# Altium project radxa_cm5_io_board_v2200_SCH-1.PrjPcb (part 5 of 5)

## Sheet 19_KEY_LED.SchDoc
size 246 x 182 mm
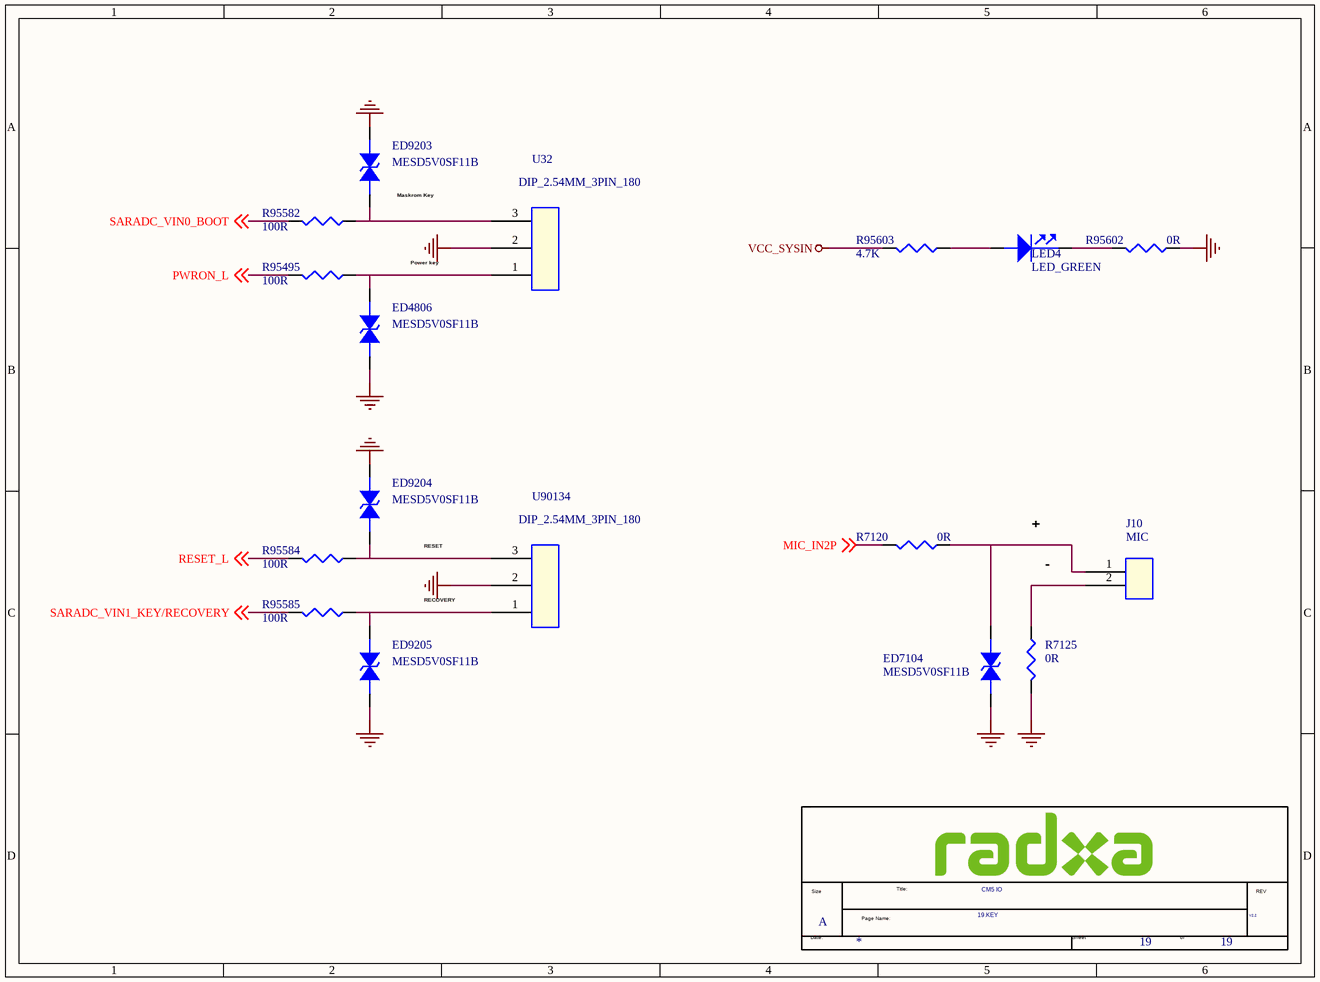
[diagram p19: 19_KEY_LED.SchDoc]

### Parts
(Parts that share a designator on the sheet are numbered #1, #2 ... from top to bottom, then left to right.)
*#19  Doc: 19.KEY  RevCode: V2.2  Title: CM5 IO  Page Size: A  Page Number: 19  (hidden comment: radxa_1010)  (graphical)
ED4806  MESD5V0SF11B  [E0402N]
ED7104  MESD5V0SF11B  [ESD0402]
ED9203  MESD5V0SF11B  [E0402N]
ED9204  MESD5V0SF11B  [E0402N]
ED9205  MESD5V0SF11B  [E0402N]
J10  MIC  [DIP2PIN-2P54MM]
LED4  LED_GREEN  [LED0603]
R7120  0R  [R0402]
R7125  0R  [R0402]
R95495  100R  [R0402]
R95582  100R  [R0402]
R95584  100R  [R0402]
R95585  100R  [R0402]
R95602  0R  [R0402]
R95603  4.7K  [R0402]
U32  DIP_2.54MM_3PIN_180  [DIP3_1X2P54]
U90134  DIP_2.54MM_3PIN_180  [DIP3_1X2P54]

### Nets
GND: ED4806.2 ED7104.2 ED9203.2 ED9204.2 ED9205.2 R7125.2 R95602.2 U32.2 U90134.2
VCC_SYSIN: R95603.1
MIC_IN2P: R7120.1 ; off-sheet MIC_IN2P
PWRON_L: R95495.1 ; off-sheet PWRON_L
RESET_L: R95584.1 ; off-sheet RESET_L
SARADC_VIN0_BOOT: R95582.1 ; off-sheet SARADC_VIN0_BOOT
SARADC_VIN1_KEY/RECOVERY: R95585.1 ; off-sheet SARADC_VIN1_KEY/RECOVERY
NetED4806_1: ED4806.1 R95495.2 U32.1
NetED7104_1: ED7104.1 J10.1 R7120.2
NetED9203_1: ED9203.1 R95582.2 U32.3
NetED9204_1: ED9204.1 R95584.2 U90134.3
NetED9205_1: ED9205.1 R95585.2 U90134.1
NetJ10_2: J10.2 R7125.1
NetLED4_1: LED4.1(ANODE) R95603.2
NetLED4_2: LED4.2(CATHODE) R95602.1

### Notes on the sheet
- (near ED9203) Maskrom Key
- Power key
- +
- RESET
- RECOVERY
- -
- (in symbol radxa_1010) Size; Title:; REV; Page Name:; Date:; Sheet; of

### Library data of the parts
ED4806 ED9203 = TVS: ESD Component,5V,30P,SMD,0402; BOM_TYPE: 40; BOM_VALUE: 0; PCB Footprint: E0402N
ED7104 = DIODE BI_DIR TRIG_2: 1-Line, Bi-directional, Transient Voltage Suppressors.17.5pF.; Manufacturer: WillSemi(韦尔半导体); RK PN: ESD5451N; Priority: A; PCB Footprint: ESD0402; Part Type: ESD_TVS; Manufacturer PN: ESD5451N; Created by: JJJ
ED9204 ED9205 = TVS: ESD Component,5V,30P,SMD,0402; BOM_VALUE: 0; BOM_TYPE: 40; PCB Footprint: E0402N
J10 = CON2: PCB Footprint: DIP2PIN-2P54MM
LED4 = LED: 贴片LED灯，0603，绿色; Priority: A; PCB Footprint: LED0603; Created by: JJJ; Part Type: LED; RK PN: LED_GREEN
R7120 = RESISTOR_1: 通用厚膜电阻,0R,+/-5%,R0402,1/16W.; Manufacturer PN: RC0402JR-070RL; Manufacturer: YAGEO; Tolerance: 5%; Wattage: 1/16W; Priority: A; PCB Footprint: R0402; Created by: YTL; Part Type: 通用厚膜电阻; RK PN: RC0402JR-070RL
R7125 = RESISTOR_1: 通用厚膜电阻,2K2,+/-1%,R0402,1/16W.; Manufacturer PN: RC0402FR-072K2L; Manufacturer: YAGEO; Tolerance: 1%; Wattage: 1/16W; Priority: A; PCB Footprint: R0402; Created by: YTL; Part Type: 通用厚膜电阻; RK PN: RC0402FR-072K2L
R95495 R95582 R95602 = RESISTOR_1_Dup1: 通用厚膜电阻,49K9,+/-1%,R0402,1/16W.; Manufacturer PN: RC0402FR-0749K9L; Manufacturer: YAGEO; Tolerance: 1%; Wattage: 1/16W; Priority: A; PCB Footprint: R0402; Created by: YTL; Part Type: 通用厚膜电阻; RK PN: RC0402FR-0749K9L
R95584 R95585 R95603 = RESISTOR_1_Dup1: 通用厚膜电阻,49K9,+/-1%,R0402,1/16W.; Manufacturer: YAGEO; Tolerance: 1%; RK PN: RC0402FR-0749K9L; Priority: A; Wattage: 1/16W; PCB Footprint: R0402; Part Type: 通用厚膜电阻; Manufacturer PN: RC0402FR-0749K9L; Created by: YTL
U32 U90134 = CON3_1: PCB Footprint: DIP3_1X2P54
*#19 = radxa_1010: Page Create Date: March  8, 1995; Page Count: 19; Page Modify Date: *

## Nets that join several sheets
GND: 04_HDMII_TX (19 pins), 05_Ethernet (10 pins), 06_MicroSD_Card (14 pins), 07_PCIE_WIFI (25 pins), 08_AUDIO (25 pins), 09_MIPI_LCD_TX1 (7 pins), 10_MIPI_LCD_TX2 (30 pins), 11_MIPI_CAM_RX (21 pins), 12_USB_HUB (16 pins), 13_USB30_USB20 (35 pins), 14_FAN_RTC (11 pins), 15_Power_DCIN (57 pins), 16_40PIN_Connector (17 pins), 17_Connector (81 pins), 18_Type_C (40 pins), 19_KEY_LED (9 pins)
VCC3V3_SYS: 05_Ethernet (R4.2 R10.2), 09_MIPI_LCD_TX1 (FB6.1), 10_MIPI_LCD_TX2 (R95530.1), 11_MIPI_CAM_RX (FB2.1 FB7.1), 15_Power_DCIN (8 pins), 16_40PIN_Connector (CON1.1 CON1.17)
VCC5V0_SYS: 04_HDMII_TX (D1.1), 07_PCIE_WIFI (C265.1 U90077.4), 10_MIPI_LCD_TX2 (C558.1 C559.1 Q9514.2 R95041.1), 11_MIPI_CAM_RX (R316.1), 14_FAN_RTC (C126.2 C127.2 D37.2 U26.2), 15_Power_DCIN (15 pins), 16_40PIN_Connector (C90789.1 C90790.1 CON1.2 CON1.4), 17_Connector (R95616.2), 18_Type_C (7 pins)
VCC5V0_USB: 12_USB_HUB (C85.1 L4.1), 13_USB30_USB20 (5 pins), 15_Power_DCIN (C130.1 C131.1 R148.1)
VCC_1V8_S0: 07_PCIE_WIFI (R95209.1), 08_AUDIO (R90337.1 R95557.1 R95558.1), 10_MIPI_LCD_TX2 (C90618.2 R95467.1 U90089.B2 U90089.C2), 12_USB_HUB (R2311.1), 17_Connector (U33#2.88 U33#2.90)
VCC_1V8_S3: 06_MicroSD_Card (R4203.2), 07_PCIE_WIFI (C90784.2 U90135.B2 U90135.C2), 10_MIPI_LCD_TX2 (C90788.2 U90136.B2 U90136.C2), 16_40PIN_Connector (7 pins)
VCC_3V3_S0: 08_AUDIO (C573.1 C574.1 U90129.22), 12_USB_HUB (9 pins)
VCC_3V3_S3: 06_MicroSD_Card (Q1.2 R12.1 R220.1), 10_MIPI_LCD_TX2 (U90089.A2 U90136.A2), 12_USB_HUB (C2330.1 R95607.1 U2305.5), 14_FAN_RTC (D90038.1), 15_Power_DCIN (R95572.1), 16_40PIN_Connector (7 pins), 17_Connector (R9241.1 U33#2.84 U33#2.86), 18_Type_C (C2614.1 R2613.1 U2602.3 U2602.4)
VCC_SYSIN: 15_Power_DCIN (10 pins), 17_Connector (6 pins), 19_KEY_LED (R95603.1)
VCCIO_FLASH: 14_FAN_RTC (R95374.2 R95375.1), 16_40PIN_Connector (R95589.1), 17_Connector (U33#2.73)
BT_HOST_WAKE: 07_PCIE_WIFI (R95586.1), 17_Connector (J24.85)
BT_REG_ON_H: 07_PCIE_WIFI (R95143.1 R95148.1 R95153.1), 17_Connector (J24.98)
CC_INT0_L: 17_Connector (J24.96), 18_Type_C (R95599.1)
GPIO0_C2: 16_40PIN_Connector (CON1.12), 17_Connector (J24.93)
GPIO0_C7: 16_40PIN_Connector (CON1.31 R95590.2), 17_Connector (U33#2.56)
GPIO0_D0: 16_40PIN_Connector (CON1.29 R95591.2), 17_Connector (U33#2.58)
GPIO0_D3: 16_40PIN_Connector (CON1.40), 17_Connector (J24.94)
GPIO1_A6_CAM1: 10_MIPI_LCD_TX2 (R95595.1 U90089.B3), 17_Connector (U33#2.45)
GPIO1_A6_CAM1_E: 10_MIPI_LCD_TX2 (R95595.2 U90089.B1), 11_MIPI_CAM_RX (R95570.1)
GPIO1_B1_S: 16_40PIN_Connector (U90133.A3), 17_Connector (U33#2.40)
GPIO1_B2_CAM1: 10_MIPI_LCD_TX2 (R95594.1 U90089.A3), 17_Connector (U33#2.44)
GPIO1_B2_CAM1_E: 10_MIPI_LCD_TX2 (R95594.2 U90089.A1), 11_MIPI_CAM_RX (R95571.1)
GPIO1_B6_CAM2_CLK: 11_MIPI_CAM_RX (R715.1), 17_Connector (J24.10)
GPIO1_B7: 16_40PIN_Connector (U90133.B3), 17_Connector (J24.12)
GPIO1_C1: 15_Power_DCIN (R159.1), 16_40PIN_Connector (U90133.C3), 17_Connector (J24.20)
GPIO1_C4_S: 16_40PIN_Connector (U90132.A3), 17_Connector (J24.79)
GPIO1_C6_S: 16_40PIN_Connector (U90132.C3), 17_Connector (J24.75)
GPIO1_D2_S: 16_40PIN_Connector (U90132.D3), 17_Connector (J24.83)
GPIO1_D5_S: 16_40PIN_Connector (U90132.B3), 17_Connector (J24.77)
GPIO3_B7: 16_40PIN_Connector (CON1.26 R95592.2), 17_Connector (J24.6)
GPIO3_C0: 16_40PIN_Connector (CON1.35 R95593.2), 17_Connector (J24.4)
GPIO4_A4: 16_40PIN_Connector (CON1.15), 17_Connector (J24.38)
GPIO4_A5: 16_40PIN_Connector (CON1.13), 17_Connector (J24.40)
GPIO4_A6: 16_40PIN_Connector (CON1.11), 17_Connector (J24.89)
GPIO4_A7: 16_40PIN_Connector (CON1.7), 17_Connector (J24.87)
GSENSOR_INT: 10_MIPI_LCD_TX2 (R95541.2), 17_Connector (U33#2.29)
HDMI0_TX0N: 04_HDMII_TX (L5005.2 R957.1), 17_Connector (U33#1.184)
HDMI0_TX0P: 04_HDMII_TX (L5005.1 R956.1), 17_Connector (U33#1.182)
HDMI0_TX1N: 04_HDMII_TX (L5004.2 R955.1), 17_Connector (U33#1.178)
HDMI0_TX1P: 04_HDMII_TX (L5004.1 R954.1), 17_Connector (U33#1.176)
HDMI0_TX2N: 04_HDMII_TX (L5003.2 R953.1), 17_Connector (U33#1.172)
HDMI0_TX2P: 04_HDMII_TX (L5003.1 R952.1), 17_Connector (U33#1.170)
HDMI0_TX3N: 04_HDMII_TX (L5006.2 R959.1), 17_Connector (U33#1.190)
HDMI0_TX3P: 04_HDMII_TX (L5006.1 R958.1), 17_Connector (U33#1.188)
HDMI0_TX_SBDN_C: 04_HDMII_TX (C90430.1), 17_Connector (U33#1.147)
HDMI0_TX_SBDP_C: 04_HDMII_TX (C90429.1), 17_Connector (U33#1.145)
HDMI_TX0_CEC_PORT: 04_HDMII_TX (ED9206.1 J1.13), 17_Connector (U33#1.151)
HDMI_TX0_HPD_M0: 04_HDMII_TX (R95282.1 R95615.1), 17_Connector (U33#1.153)
HDMI_TX0_SCL_5V: 04_HDMII_TX (ED3.1 J1.15), 17_Connector (U33#1.200)
HDMI_TX0_SDA_5V: 04_HDMII_TX (ED2.1 J1.16), 17_Connector (U33#1.199)
HOST_WAKE_BT_H: 07_PCIE_WIFI (R95147.1 R95152.1 R95154.1), 17_Connector (U33#2.91)
HP_DET_L: 08_AUDIO (R90341.2), 17_Connector (J24.36)
HP_INT: 08_AUDIO (R95573.2), 17_Connector (U33#2.20)
I2C4_SCL_M3_WIFI: 07_PCIE_WIFI (U90135.D3), 17_Connector (U33#2.49)
I2C4_SDA_M3_WIFI: 07_PCIE_WIFI (U90135.C3), 17_Connector (U33#2.25)
I2C6_SCL_M3: 14_FAN_RTC (R120.2), 17_Connector (J24.71), 18_Type_C (U2602.6)
I2C6_SDA_M3: 14_FAN_RTC (R95377.2), 17_Connector (J24.69), 18_Type_C (U2602.7)
I2C7_SCL_M2: 09_MIPI_LCD_TX1 (J6.5), 11_MIPI_CAM_RX (J7.3), 16_40PIN_Connector (CON1.5), 17_Connector (U33#2.80)
I2C7_SDA_M2: 09_MIPI_LCD_TX1 (J6.4), 11_MIPI_CAM_RX (J7.2), 16_40PIN_Connector (CON1.3), 17_Connector (U33#2.82)
I2C8_SCL_M2: 10_MIPI_LCD_TX2 (R95472.1 U90136.B1), 16_40PIN_Connector (R95612.2)
I2C8_SCL_M2_CAM: 08_AUDIO (U90129.1), 10_MIPI_LCD_TX2 (U90136.B3), 11_MIPI_CAM_RX (J5002.24), 17_Connector (U33#2.35)
I2C8_SDA_M2: 10_MIPI_LCD_TX2 (R95471.1 U90136.A1), 16_40PIN_Connector (R95609.1)
I2C8_SDA_M2_CAM: 08_AUDIO (U90129.32), 10_MIPI_LCD_TX2 (U90136.A3), 11_MIPI_CAM_RX (J5002.25), 17_Connector (U33#2.36)
I2S0_LRCK_TX: 08_AUDIO (U90129.8), 17_Connector (U33#2.48)
I2S0_MCLK: 08_AUDIO (U90129.2), 17_Connector (U33#2.50)
I2S0_SCLK_TX: 08_AUDIO (U90129.6), 17_Connector (U33#2.46)
I2S0_SDI0: 08_AUDIO (U90129.9), 17_Connector (U33#2.54)
I2S0_SDO0: 08_AUDIO (U90129.7), 17_Connector (U33#2.34)
LCD_PWREN_H: 10_MIPI_LCD_TX2 (R95042.1), 17_Connector (J24.34)
LCD_RESET_L: 10_MIPI_LCD_TX2 (R95468.1), 17_Connector (U33#2.41)
MIC_IN2P: 08_AUDIO (6 pins), 19_KEY_LED (R7120.1)
MIPI_CAM2_PDN_L: 11_MIPI_CAM_RX (R814.1), 17_Connector (U33#2.47)
MIPI_CAM2_RST_L: 11_MIPI_CAM_RX (R95580.1), 17_Connector (U33#2.38)
MIPI_CSI0_RX_CLK0N: 11_MIPI_CAM_RX (J7.8), 17_Connector (U33#1.140)
MIPI_CSI0_RX_CLK0P: 11_MIPI_CAM_RX (J7.7), 17_Connector (U33#1.142)
MIPI_CSI0_RX_D0N: 11_MIPI_CAM_RX (J7.14), 17_Connector (U33#1.128)
MIPI_CSI0_RX_D0P: 11_MIPI_CAM_RX (J7.13), 17_Connector (U33#1.130)
MIPI_CSI0_RX_D1N: 11_MIPI_CAM_RX (J7.11), 17_Connector (U33#1.134)
MIPI_CSI0_RX_D1P: 11_MIPI_CAM_RX (J7.10), 17_Connector (U33#1.136)
MIPI_DPHY0_RX_CLKN: 11_MIPI_CAM_RX (J5002.17), 17_Connector (U33#1.127)
MIPI_DPHY0_RX_CLKP: 11_MIPI_CAM_RX (J5002.18), 17_Connector (U33#1.129)
MIPI_DPHY0_RX_D0N: 11_MIPI_CAM_RX (J5002.14), 17_Connector (U33#1.115)
MIPI_DPHY0_RX_D0P: 11_MIPI_CAM_RX (J5002.15), 17_Connector (U33#1.117)
MIPI_DPHY0_RX_D1N: 11_MIPI_CAM_RX (J5002.11), 17_Connector (U33#1.121)
MIPI_DPHY0_RX_D1P: 11_MIPI_CAM_RX (J5002.12), 17_Connector (U33#1.123)
MIPI_DPHY0_RX_D2N: 11_MIPI_CAM_RX (J5002.5), 17_Connector (U33#1.133)
MIPI_DPHY0_RX_D2P: 11_MIPI_CAM_RX (J5002.6), 17_Connector (U33#1.135)
MIPI_DPHY0_RX_D3N: 11_MIPI_CAM_RX (J5002.2), 17_Connector (U33#1.139)
MIPI_DPHY0_RX_D3P: 11_MIPI_CAM_RX (J5002.3), 17_Connector (U33#1.141)
MIPI_DPHY0_TX_CLKN: 09_MIPI_LCD_TX1 (J6.11), 17_Connector (U33#1.169)
MIPI_DPHY0_TX_CLKP: 09_MIPI_LCD_TX1 (J6.10), 17_Connector (U33#1.171)
MIPI_DPHY0_TX_D0N: 09_MIPI_LCD_TX1 (J6.8), 17_Connector (U33#1.157)
MIPI_DPHY0_TX_D0P: 09_MIPI_LCD_TX1 (J6.7), 17_Connector (U33#1.159)
MIPI_DPHY0_TX_D1N: 09_MIPI_LCD_TX1 (J6.14), 17_Connector (U33#1.163)
MIPI_DPHY0_TX_D1P: 09_MIPI_LCD_TX1 (J6.13), 17_Connector (U33#1.165)
MIPI_DPHY1_TX_CLKN: 10_MIPI_LCD_TX2 (U90104.13), 17_Connector (U33#1.187)
MIPI_DPHY1_TX_CLKP: 10_MIPI_LCD_TX2 (U90104.14), 17_Connector (U33#1.189)
MIPI_DPHY1_TX_D0N: 10_MIPI_LCD_TX2 (U90104.7), 17_Connector (U33#1.175)
MIPI_DPHY1_TX_D0P: 10_MIPI_LCD_TX2 (U90104.8), 17_Connector (U33#1.177)
MIPI_DPHY1_TX_D1N: 10_MIPI_LCD_TX2 (U90104.10), 17_Connector (U33#1.181)
MIPI_DPHY1_TX_D1P: 10_MIPI_LCD_TX2 (U90104.11), 17_Connector (U33#1.183)
MIPI_DPHY1_TX_D2N: 10_MIPI_LCD_TX2 (U90104.16), 17_Connector (U33#1.193)
MIPI_DPHY1_TX_D2P: 10_MIPI_LCD_TX2 (U90104.17), 17_Connector (U33#1.195)
MIPI_DPHY1_TX_D3N: 10_MIPI_LCD_TX2 (U90104.19), 17_Connector (U33#1.194)
MIPI_DPHY1_TX_D3P: 10_MIPI_LCD_TX2 (U90104.20), 17_Connector (U33#1.196)
PCIE20_0_REFCLKN: 07_PCIE_WIFI (U4301.49), 17_Connector (U33#1.112)
PCIE20_0_REFCLKP: 07_PCIE_WIFI (U4301.47), 17_Connector (U33#1.110)
PCIE20_0_RXN: 07_PCIE_WIFI (U4301.43), 17_Connector (U33#1.118)
PCIE20_0_RXP: 07_PCIE_WIFI (U4301.41), 17_Connector (U33#1.116)
PCIE20_0_TXN: 07_PCIE_WIFI (C90393.1), 17_Connector (U33#1.124)
PCIE20_0_TXP: 07_PCIE_WIFI (C90392.1), 17_Connector (U33#1.122)
PCIE20x1_2_CLKREQn_M0: 07_PCIE_WIFI (R95144.1 R95151.1), 17_Connector (U33#1.102)
PCIE20x1_2_PERSTn_M0: 07_PCIE_WIFI (R95145.1), 17_Connector (U33#1.109)
PCIE20x1_2_WAKEn_M0: 07_PCIE_WIFI (R95146.1), 17_Connector (U33#2.24)
PHY1_LED0_Y1: 05_Ethernet (R6.1), 17_Connector (U33#2.19)
PHY1_LED1_G: 05_Ethernet (D3.2 R2.2 R3.1), 17_Connector (U33#2.17)
PHY1_LED2_Y: 05_Ethernet (R5.1), 17_Connector (U33#2.15)
PHY1_MDI0+: 05_Ethernet (J3.1 U5.1 U5.10), 17_Connector (U33#2.12)
PHY1_MDI0-: 05_Ethernet (J3.2 U5.2 U5.9), 17_Connector (U33#2.10)
PHY1_MDI1+: 05_Ethernet (J3.3 U5.4 U5.7), 17_Connector (U33#2.4)
PHY1_MDI1-: 05_Ethernet (J3.6 U5.5 U5.6), 17_Connector (U33#2.6)
PHY1_MDI2+: 05_Ethernet (J3.7 U6.1 U6.10), 17_Connector (U33#2.11)
PHY1_MDI2-: 05_Ethernet (J3.8 U6.2 U6.9), 17_Connector (U33#2.9)
PHY1_MDI3+: 05_Ethernet (J3.9 U6.4 U6.7), 17_Connector (U33#2.3)
PHY1_MDI3-: 05_Ethernet (J3.10 U6.5 U6.6), 17_Connector (U33#2.5)
PWM4_M0: 14_FAN_RTC (R214.2), 17_Connector (U33#2.89)
PWM11_M3: 14_FAN_RTC (R215.2), 17_Connector (J24.18)
PWM15_M1: 10_MIPI_LCD_TX2 (R95073.1 R95137.1), 17_Connector (U33#2.21)
PWRON_L: 17_Connector (U33#2.99), 19_KEY_LED (R95495.1)
RESET_L: 17_Connector (U33#2.92), 19_KEY_LED (R95584.1)
RTC_32K_IN: 07_PCIE_WIFI (R95155.1), 14_FAN_RTC (R95028.2)
RTC_32K_SOC: 07_PCIE_WIFI (R95581.1), 17_Connector (J24.90 R95614.1)
RTC_INT_L: 14_FAN_RTC (R121.1 R95375.2), 17_Connector (J24.81)
SARADC_VIN0_BOOT: 17_Connector (U33#2.93), 19_KEY_LED (R95582.1)
SARADC_VIN1_KEY/RECOVERY: 17_Connector (J24.26), 19_KEY_LED (R95585.1)
SARADC_VIN2_DC: 15_Power_DCIN (R153.1), 17_Connector (J24.28)
SARADC_VIN3_HP_HOOK: 08_AUDIO (C7322.1 R7314.1 R7315.2), 17_Connector (J24.30)
SARADC_VIN4: 16_40PIN_Connector (CON1.37), 17_Connector (U33#2.96)
SD_PWR_ON: 06_MicroSD_Card (R13.2), 07_PCIE_WIFI (R95613.2), 17_Connector (U33#2.75)
SDMMC_CLK: 06_MicroSD_Card (R11.1), 17_Connector (U33#2.57)
SDMMC_CMD: 06_MicroSD_Card (CN14A1.3 ED13.1), 17_Connector (U33#2.62)
SDMMC_D0: 06_MicroSD_Card (CN14A1.7 ED11.1), 17_Connector (U33#2.63)
SDMMC_D1: 06_MicroSD_Card (CN14A1.8 ED10.1), 17_Connector (U33#2.67)
SDMMC_D2: 06_MicroSD_Card (CN14A1.1 ED15.1), 17_Connector (U33#2.69)
SDMMC_D3: 06_MicroSD_Card (CN14A1.2 ED14.1), 17_Connector (U33#2.61)
SDMMC_DET_L: 06_MicroSD_Card (R90334.1), 17_Connector (J24.74)
SPIO_CLK_M1: 16_40PIN_Connector (CON1.23), 17_Connector (U33#2.30)
SPIO_CS0M1: 16_40PIN_Connector (CON1.24), 17_Connector (U33#2.31)
SPIO_MISO_M1: 16_40PIN_Connector (CON1.21), 17_Connector (U33#2.100)
SPIO_MOSI_M1: 16_40PIN_Connector (CON1.19), 17_Connector (U33#2.28)
TP_INT_L: 10_MIPI_LCD_TX2 (R95596.1 U90089.C3), 17_Connector (U33#2.37)
TP_RST_L: 10_MIPI_LCD_TX2 (R95597.1 U90089.D3), 17_Connector (U33#2.39)
TYPEC0_OTG_DM: 17_Connector (U33#1.103), 18_Type_C (R91188.1)
TYPEC0_OTG_DP: 17_Connector (U33#1.105), 18_Type_C (R91189.1)
TYPEC0_SBU1: 17_Connector (J24.3), 18_Type_C (C2010.1)
TYPEC0_SBU1_DC: 17_Connector (J24.8), 18_Type_C (R2004.1)
TYPEC0_SBU2: 17_Connector (J24.5), 18_Type_C (C2011.1)
TYPEC0_SBU2_DC: 17_Connector (J24.14), 18_Type_C (R2007.1)
TYPEC0_SSRX1N: 17_Connector (J24.11), 18_Type_C (R2013.1)
TYPEC0_SSRX1P: 17_Connector (J24.9), 18_Type_C (R2015.1)
TYPEC0_SSRX2N: 17_Connector (J24.23), 18_Type_C (R2016.1)
TYPEC0_SSRX2P: 17_Connector (J24.21), 18_Type_C (R2017.1)
TYPEC0_SSTX1N: 17_Connector (J24.17), 18_Type_C (C2013.1)
TYPEC0_SSTX1P: 17_Connector (J24.15), 18_Type_C (C2014.1)
TYPEC0_SSTX2N: 17_Connector (J24.29), 18_Type_C (C2019.1)
TYPEC0_SSTX2P: 17_Connector (J24.27), 18_Type_C (C2020.1)
TYPEC5V_PWREN_H: 17_Connector (J24.95), 18_Type_C (R2611.1 U2603.4)
UART2_RX_M0: 16_40PIN_Connector (R168.2), 17_Connector (U33#2.51)
UART2_TX_M0: 16_40PIN_Connector (R167.2), 17_Connector (U33#2.55)
USB1_DM: 12_USB_HUB (U17.11), 13_USB30_USB20 (L90027.2 R249.2)
USB1_DP: 12_USB_HUB (U17.12), 13_USB30_USB20 (L90027.1 R250.2)
USB2_DM: 12_USB_HUB (U17.9), 13_USB30_USB20 (L5012.4 R253.1)
USB2_DP: 12_USB_HUB (U17.10), 13_USB30_USB20 (L5012.3 R254.1)
USB3_DM: 07_PCIE_WIFI (FB261.1 R95142.2), 12_USB_HUB (U17.7)
USB3_DP: 07_PCIE_WIFI (FB261.2 R95141.2), 12_USB_HUB (U17.8)
USB4_DM: 12_USB_HUB (U17.5), 16_40PIN_Connector (R95611.2)
USB4_DP: 12_USB_HUB (U17.6), 16_40PIN_Connector (R95610.1)
USB20_HOST0_DM: 12_USB_HUB (U17.14), 17_Connector (J24.65)
USB20_HOST0_DP: 12_USB_HUB (U17.15), 17_Connector (J24.63)
USB20_HOST1_DM: 13_USB30_USB20 (R95552.1), 17_Connector (J24.47)
USB20_HOST1_DP: 13_USB30_USB20 (R95551.1), 17_Connector (J24.45)
USB30_2_SSRXN: 13_USB30_USB20 (R91181.1), 17_Connector (J24.59)
USB30_2_SSRXP: 13_USB30_USB20 (R91182.1), 17_Connector (J24.57)
USB30_2_SSTXN: 13_USB30_USB20 (C2280.1), 17_Connector (J24.53)
USB30_2_SSTXP: 13_USB30_USB20 (C2281.1), 17_Connector (J24.51)
USB_HOST_PWREN_H: 13_USB30_USB20 (5 pins), 17_Connector (U33#2.97)
WIFI_LED: 07_PCIE_WIFI (R95583.1), 17_Connector (U33#2.95)
WIFI_PWR_EN: 07_PCIE_WIFI (R95239.1), 17_Connector (J24.24)
WIFI_REG_ON_E: 07_PCIE_WIFI (R95587.1 U90135.B3), 17_Connector (U33#2.27)